# Altium project 0x2a002a.PrjPcb
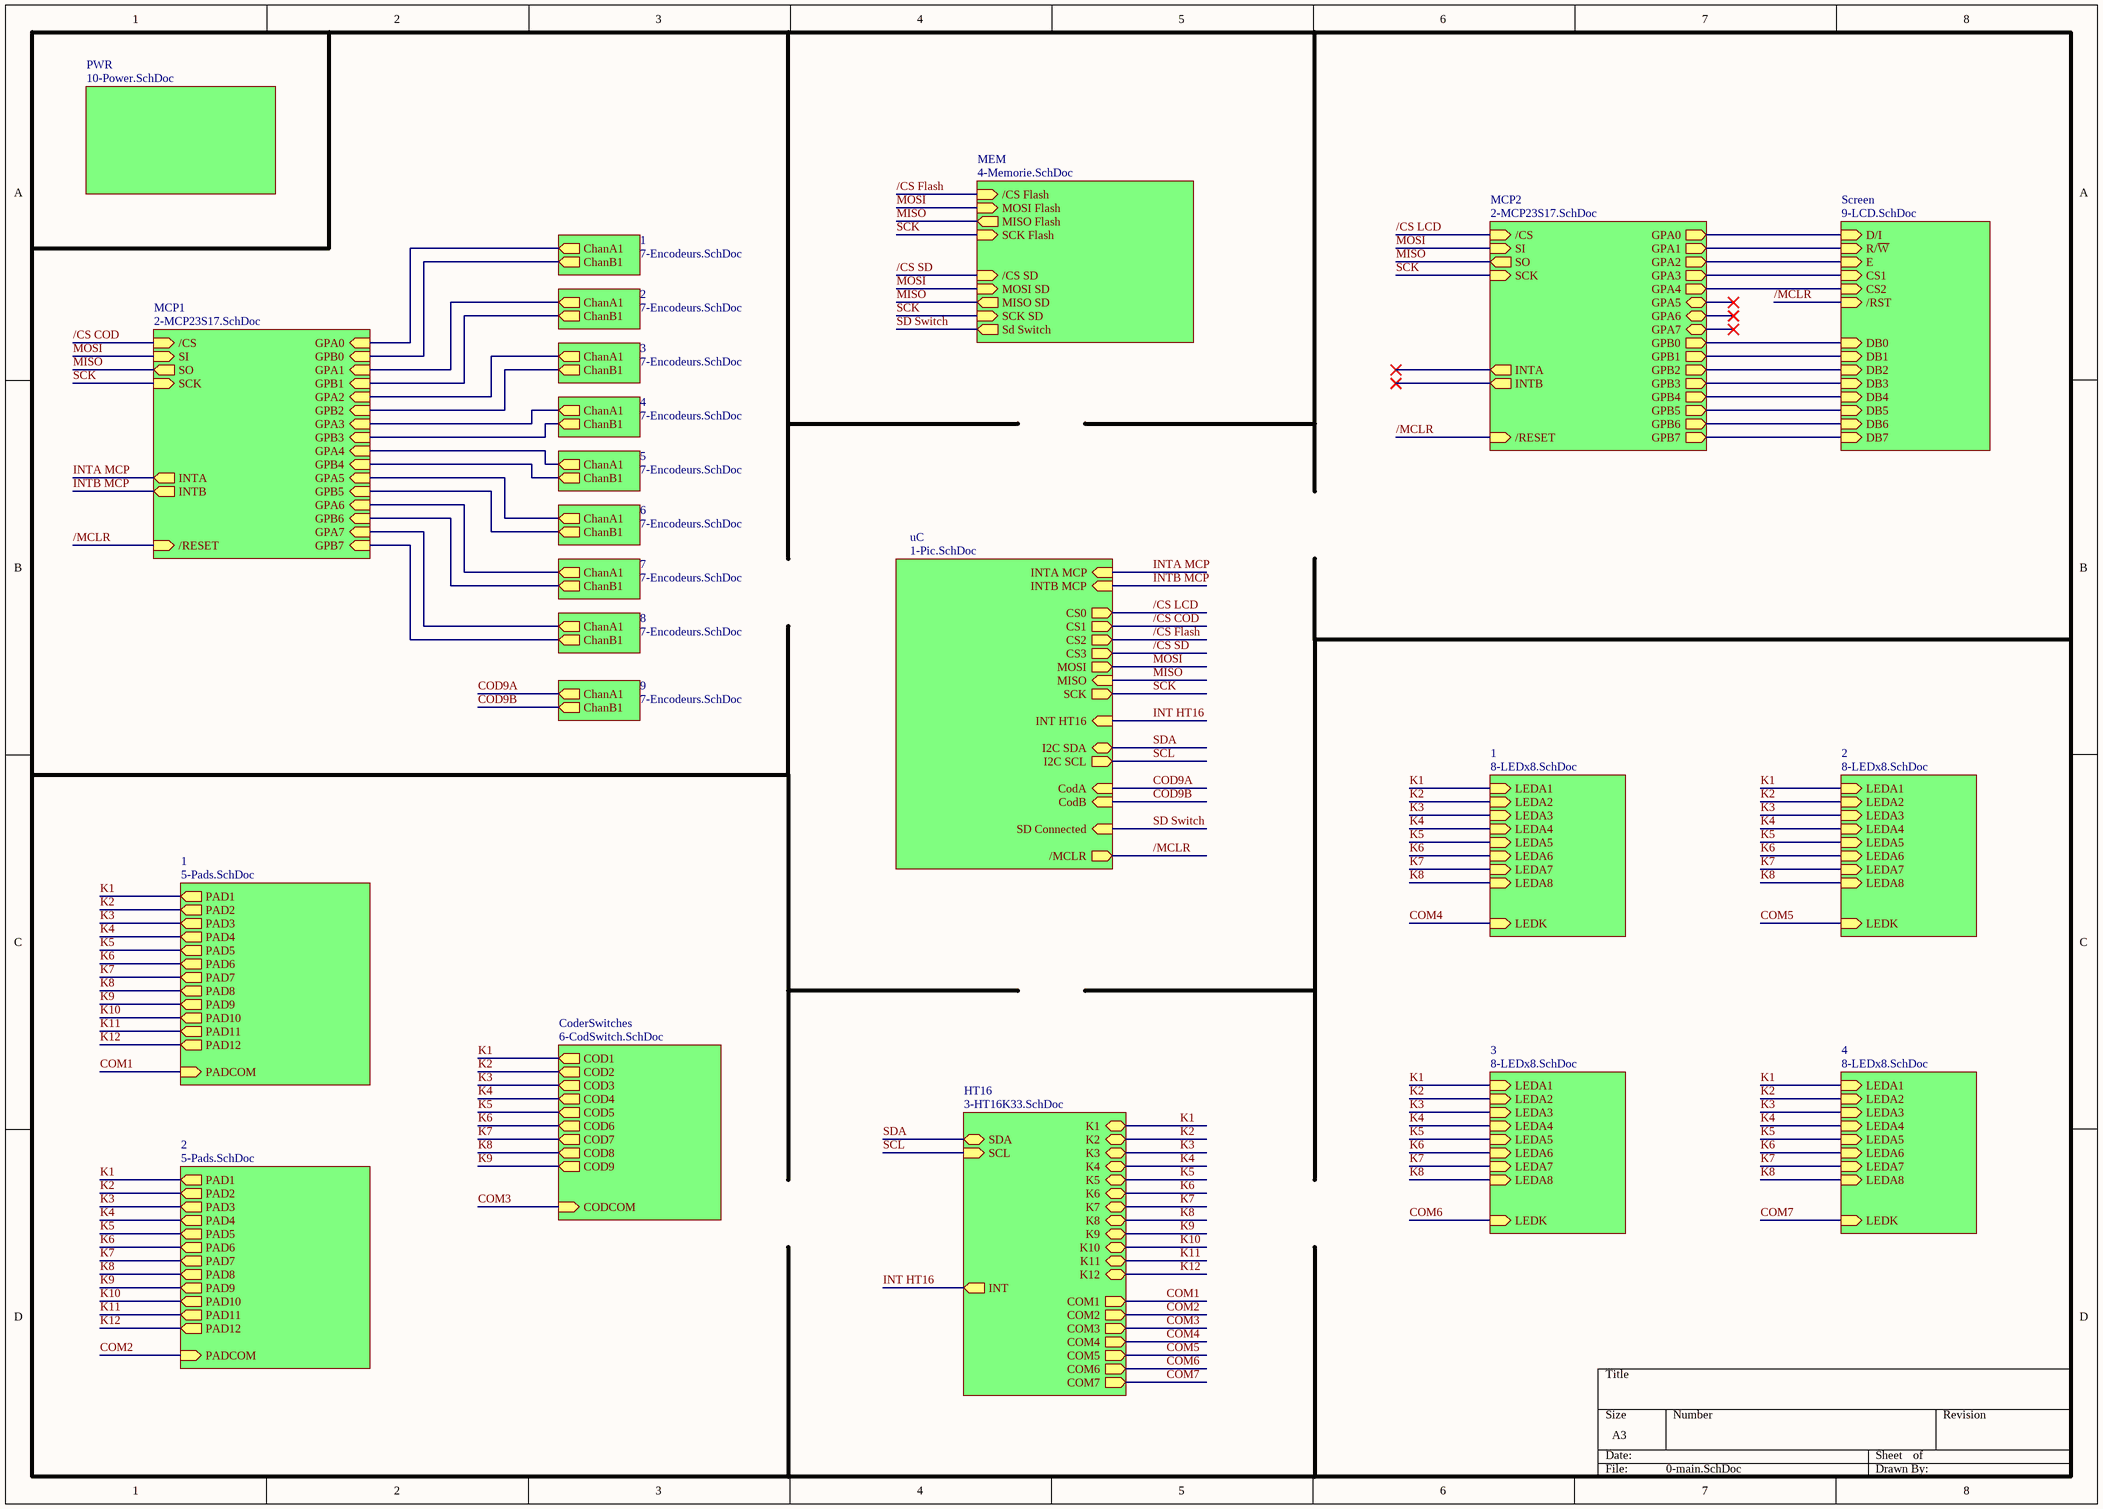
[diagram p0: 0-main.SchDoc]
11 sheets, 236 parts. Net scope: hierarchical (ports join the sheet entries above them; power ports are global).
Board file: PCB1.PcbDoc
Sheets:
  0-main.SchDoc
    uC = 1-Pic.SchDoc
    1 = 7-Encodeurs.SchDoc
    HT16 = 3-HT16K33.SchDoc
    PWR = 10-Power.SchDoc
    MCP1 = 2-MCP23S17.SchDoc
    MEM = 4-Memorie.SchDoc
    MCP2 = 2-MCP23S17.SchDoc
    2 = 7-Encodeurs.SchDoc
    3 = 7-Encodeurs.SchDoc
    4 = 7-Encodeurs.SchDoc
    5 = 7-Encodeurs.SchDoc
    6 = 7-Encodeurs.SchDoc
    7 = 7-Encodeurs.SchDoc
    8 = 7-Encodeurs.SchDoc
    9 = 7-Encodeurs.SchDoc
    Screen = 9-LCD.SchDoc
    1 = 8-LEDx8.SchDoc
    CoderSwitches = 6-CodSwitch.SchDoc
    2 = 5-Pads.SchDoc
    2 = 8-LEDx8.SchDoc
    3 = 8-LEDx8.SchDoc
    4 = 8-LEDx8.SchDoc
    1 = 5-Pads.SchDoc

## Sheet 0-main.SchDoc
size A3

### Sub-sheets
1 = 7-Encodeurs.SchDoc: ChanA1 (out), ChanB1 (out)
1 = 8-LEDx8.SchDoc: LEDA1 (in), LEDA2 (in), LEDA4 (in), LEDA3 (in), LEDA5 (in), LEDA6 (in), LEDA7 (in), LEDA8 (in), LEDK (in)
1 = 5-Pads.SchDoc: PAD1 (out), PAD2 (out), PAD3 (out), PAD4 (out), PAD5 (out), PAD6 (out), PAD8 (out), PAD7 (out), PAD9 (out), PAD10 (out), PAD11 (out), PAD12 (out), PADCOM (in)
2 = 7-Encodeurs.SchDoc: ChanA1 (out), ChanB1 (out)
2 = 5-Pads.SchDoc: PAD1 (out), PAD2 (out), PAD3 (out), PAD4 (out), PAD5 (out), PAD6 (out), PAD8 (out), PAD7 (out), PAD9 (out), PAD10 (out), PAD11 (out), PAD12 (out), PADCOM (in)
2 = 8-LEDx8.SchDoc: LEDA1 (in), LEDA2 (in), LEDA4 (in), LEDA3 (in), LEDA5 (in), LEDA6 (in), LEDA7 (in), LEDA8 (in), LEDK (in)
3 = 7-Encodeurs.SchDoc: ChanA1 (out), ChanB1 (out)
3 = 8-LEDx8.SchDoc: LEDA1 (in), LEDA2 (in), LEDA4 (in), LEDA3 (in), LEDA5 (in), LEDA6 (in), LEDA7 (in), LEDA8 (in), LEDK (in)
4 = 7-Encodeurs.SchDoc: ChanA1 (out), ChanB1 (out)
4 = 8-LEDx8.SchDoc: LEDA1 (in), LEDA2 (in), LEDA4 (in), LEDA3 (in), LEDA5 (in), LEDA6 (in), LEDA7 (in), LEDA8 (in), LEDK (in)
5 = 7-Encodeurs.SchDoc: ChanA1 (out), ChanB1 (out)
6 = 7-Encodeurs.SchDoc: ChanA1 (out), ChanB1 (out)
7 = 7-Encodeurs.SchDoc: ChanA1 (out), ChanB1 (out)
8 = 7-Encodeurs.SchDoc: ChanA1 (out), ChanB1 (out)
9 = 7-Encodeurs.SchDoc: ChanA1 (out), ChanB1 (out)
CoderSwitches = 6-CodSwitch.SchDoc: COD1 (out), COD2 (out), COD3 (out), COD4 (out), COD5 (out), COD6 (out), COD7 (out), COD8 (out), CODCOM (in), COD9 (out)
HT16 = 3-HT16K33.SchDoc: SDA (bidir), SCL (in), COM3 (out), COM2 (out), COM1 (out), K1 (bidir), K2 (bidir), K4 (bidir), K3 (bidir), K5 (bidir), K6 (bidir), K7 (bidir), K8 (bidir), K9 (bidir), K10 (bidir), K11 (bidir), INT (out), K12 (bidir), COM4 (out), COM5 (out), COM6 (out), COM7 (out)
MCP1 = 2-MCP23S17.SchDoc: GPA0 (in), GPB0 (in), GPA1 (in), GPB1 (in), GPA2 (in), GPA3 (in), GPB2 (in), GPB3 (in), GPA4 (in), GPB4 (in), GPA5 (in), GPB5 (in), GPA6 (in), GPB6 (in), GPA7 (in), GPB7 (in), INTA (out), INTB (out), /CS (in), SCK (in), SI (in), SO (out), /RESET (in)
MCP2 = 2-MCP23S17.SchDoc: INTA (out), INTB (out), /CS (in), SCK (in), SI (in), SO (out), /RESET (in), GPA0 (out), GPB0 (out), GPA1 (out), GPB1 (out), GPA2 (out), GPA3 (out), GPB2 (out), GPB3 (out), GPA4 (out), GPB4 (out), GPA5 (bidir), GPB5 (out), GPA6 (bidir), GPB6 (out), GPA7 (bidir), GPB7 (out)
MEM = 4-Memorie.SchDoc: /CS Flash (in), MOSI Flash (in), MISO Flash (out), SCK Flash (in), /CS SD (in), MISO SD (out), MOSI SD (in), SCK SD (in), Sd Switch (out)
PWR = 10-Power.SchDoc: no entries
Screen = 9-LCD.SchDoc: D/I (in), E (in), CS1 (in), CS2 (in), DB0 (in), DB1 (in), DB2 (in), DB3 (in), DB4 (in), DB5 (in), DB6 (in), DB7 (in), /RST (in), R/~{W} (in)
uC = 1-Pic.SchDoc: CodA (in), CodB (in), SCK (out), MOSI (out), MISO (in), CS2 (out), CS1 (out), CS0 (out), INTB MCP (in), INTA MCP (in), I2C SCL (out), I2C SDA (bidir), SD Connected (in), /MCLR (out), CS3 (out), INT HT16 (in)

### Nets
/CS COD: sheet uC/CS1, sheet MCP1//CS
/CS Flash: sheet uC/CS2, sheet MEM//CS Flash
/CS LCD: sheet uC/CS0, sheet MCP2//CS
/CS SD: sheet uC/CS3, sheet MEM//CS SD
/MCLR: sheet uC//MCLR, sheet MCP1//RESET, sheet MCP2//RESET, sheet Screen//RST
COD9A: sheet uC/CodA, sheet 9/ChanA1
COD9B: sheet uC/CodB, sheet 9/ChanB1
COM1: sheet HT16/COM1, sheet 1/PADCOM
COM2: sheet HT16/COM2, sheet 2/PADCOM
COM3: sheet HT16/COM3, sheet CoderSwitches/CODCOM
COM4: sheet HT16/COM4, sheet 1/LEDK
COM5: sheet HT16/COM5, sheet 2/LEDK
COM6: sheet HT16/COM6, sheet 3/LEDK
COM7: sheet HT16/COM7, sheet 4/LEDK
INT HT16: sheet uC/INT HT16, sheet HT16/INT
INTA MCP: sheet uC/INTA MCP, sheet MCP1/INTA
INTB MCP: sheet uC/INTB MCP, sheet MCP1/INTB
K1: sheet HT16/K1, sheet 1/LEDA1, sheet CoderSwitches/COD1, sheet 2/PAD1, sheet 2/LEDA1, sheet 3/LEDA1, sheet 4/LEDA1, sheet 1/PAD1
K2: sheet HT16/K2, sheet 1/LEDA2, sheet CoderSwitches/COD2, sheet 2/PAD2, sheet 2/LEDA2, sheet 3/LEDA2, sheet 4/LEDA2, sheet 1/PAD2
K3: sheet HT16/K3, sheet 1/LEDA3, sheet CoderSwitches/COD3, sheet 2/PAD3, sheet 2/LEDA3, sheet 3/LEDA3, sheet 4/LEDA3, sheet 1/PAD3
K4: sheet HT16/K4, sheet 1/LEDA4, sheet CoderSwitches/COD4, sheet 2/PAD4, sheet 2/LEDA4, sheet 3/LEDA4, sheet 4/LEDA4, sheet 1/PAD4
K5: sheet HT16/K5, sheet 1/LEDA5, sheet CoderSwitches/COD5, sheet 2/PAD5, sheet 2/LEDA5, sheet 3/LEDA5, sheet 4/LEDA5, sheet 1/PAD5
K6: sheet HT16/K6, sheet 1/LEDA6, sheet CoderSwitches/COD6, sheet 2/PAD6, sheet 2/LEDA6, sheet 3/LEDA6, sheet 4/LEDA6, sheet 1/PAD6
K7: sheet HT16/K7, sheet 1/LEDA7, sheet CoderSwitches/COD7, sheet 2/PAD7, sheet 2/LEDA7, sheet 3/LEDA7, sheet 4/LEDA7, sheet 1/PAD7
K8: sheet HT16/K8, sheet 1/LEDA8, sheet CoderSwitches/COD8, sheet 2/PAD8, sheet 2/LEDA8, sheet 3/LEDA8, sheet 4/LEDA8, sheet 1/PAD8
K9: sheet HT16/K9, sheet CoderSwitches/COD9, sheet 2/PAD9, sheet 1/PAD9
K10: sheet HT16/K10, sheet 2/PAD10, sheet 1/PAD10
K11: sheet HT16/K11, sheet 2/PAD11, sheet 1/PAD11
K12: sheet HT16/K12, sheet 2/PAD12, sheet 1/PAD12
MISO: sheet uC/MISO, sheet MCP1/SO, sheet MEM/MISO Flash, sheet MEM/MISO SD, sheet MCP2/SO
MOSI: sheet uC/MOSI, sheet MCP1/SI, sheet MEM/MOSI Flash, sheet MEM/MOSI SD, sheet MCP2/SI
SCK: sheet uC/SCK, sheet MCP1/SCK, sheet MEM/SCK Flash, sheet MEM/SCK SD, sheet MCP2/SCK
SCL: sheet uC/I2C SCL, sheet HT16/SCL
SD Switch: sheet uC/SD Connected, sheet MEM/Sd Switch
SDA: sheet uC/I2C SDA, sheet HT16/SDA
NetR73_1_2: sheet 1/ChanA1, sheet MCP1/GPA0
NetR73_2_2: sheet MCP1/GPA1, sheet 2/ChanA1
NetR73_3_2: sheet MCP1/GPA2, sheet 3/ChanA1
NetR73_4_2: sheet MCP1/GPA3, sheet 4/ChanA1
NetR73_5_2: sheet MCP1/GPA4, sheet 5/ChanA1
NetR73_6_2: sheet MCP1/GPA5, sheet 6/ChanA1
NetR73_7_2: sheet MCP1/GPA6, sheet 7/ChanA1
NetR73_8_2: sheet MCP1/GPA7, sheet 8/ChanA1
NetR74_1_2: sheet 1/ChanB1, sheet MCP1/GPB0
NetR74_2_2: sheet MCP1/GPB1, sheet 2/ChanB1
NetR74_3_2: sheet MCP1/GPB2, sheet 3/ChanB1
NetR74_4_2: sheet MCP1/GPB3, sheet 4/ChanB1
NetR74_5_2: sheet MCP1/GPB4, sheet 5/ChanB1
NetR74_6_2: sheet MCP1/GPB5, sheet 6/ChanB1
NetR74_7_2: sheet MCP1/GPB6, sheet 7/ChanB1
NetR74_8_2: sheet MCP1/GPB7, sheet 8/ChanB1
NetU3_MCP2_1: sheet MCP2/GPB0, sheet Screen/DB0
NetU3_MCP2_2: sheet MCP2/GPB1, sheet Screen/DB1
NetU3_MCP2_3: sheet MCP2/GPB2, sheet Screen/DB2
NetU3_MCP2_4: sheet MCP2/GPB3, sheet Screen/DB3
NetU3_MCP2_5: sheet MCP2/GPB4, sheet Screen/DB4
NetU3_MCP2_6: sheet MCP2/GPB5, sheet Screen/DB5
NetU3_MCP2_7: sheet MCP2/GPB6, sheet Screen/DB6
NetU3_MCP2_8: sheet MCP2/GPB7, sheet Screen/DB7
NetU3_MCP2_21: sheet MCP2/GPA0, sheet Screen/D/I
NetU3_MCP2_22: sheet MCP2/GPA1, sheet Screen/R/~{W}
NetU3_MCP2_23: sheet MCP2/GPA2, sheet Screen/E
NetU3_MCP2_24: sheet MCP2/GPA3, sheet Screen/CS1
NetU3_MCP2_25: sheet MCP2/GPA4, sheet Screen/CS2

## Sheet 1-Pic.SchDoc
size A4
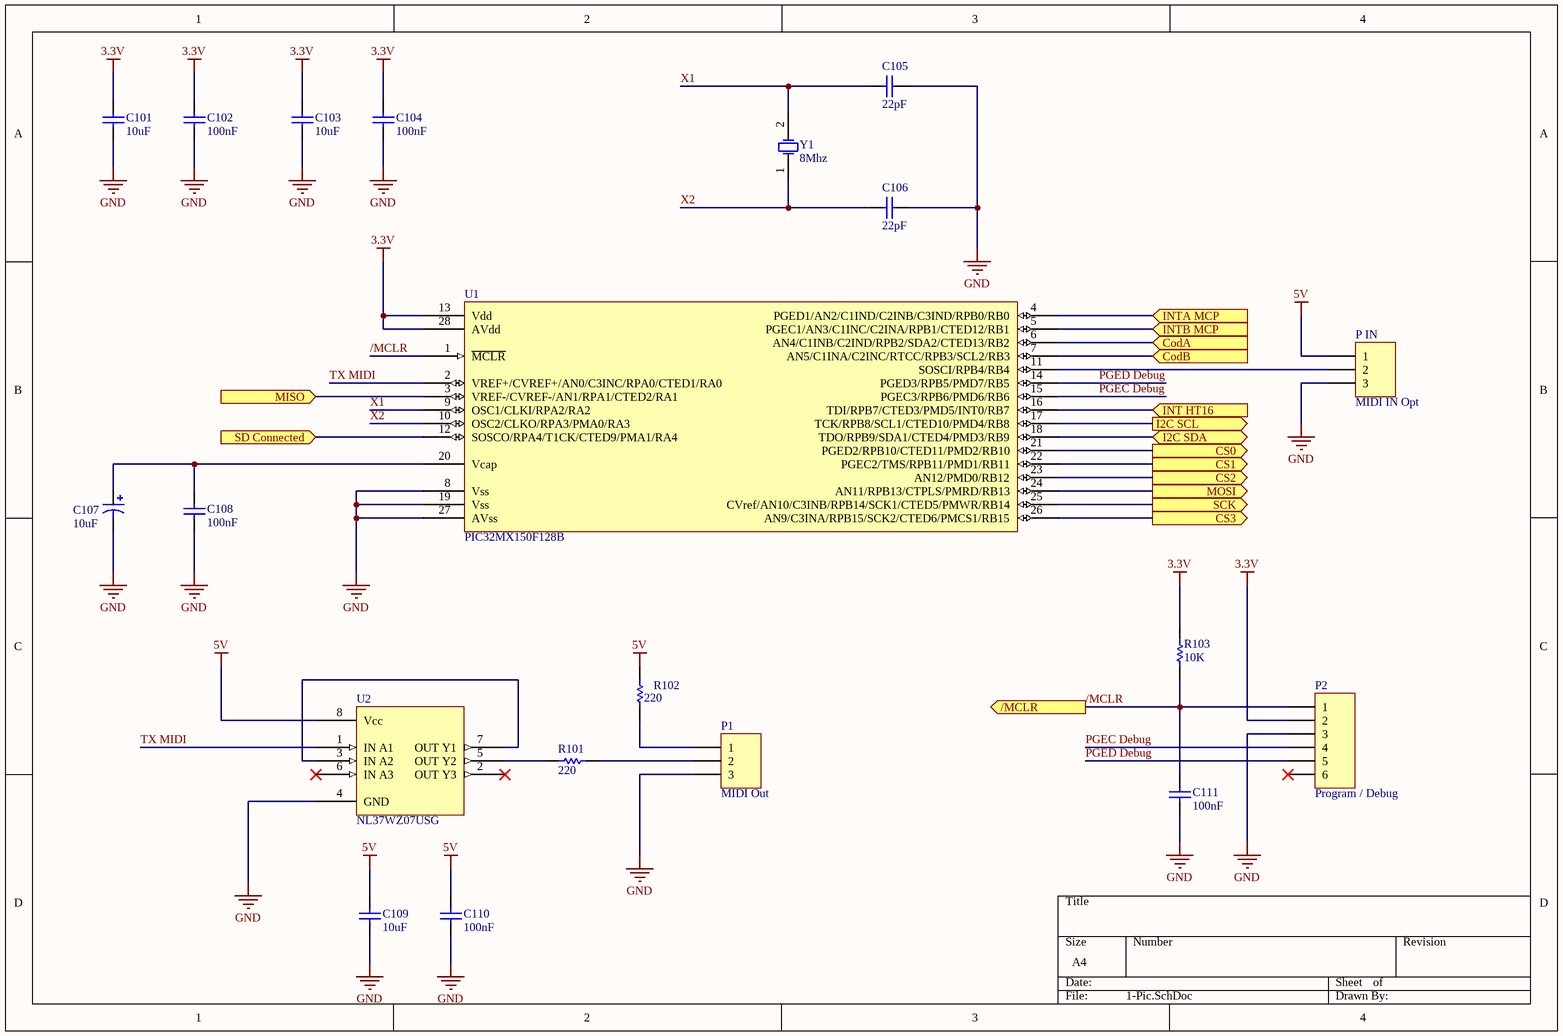
[diagram p1: 1-Pic.SchDoc]

### Parts
C101  10uF  [capa 1206]
C102  100nF  [capa 1206]
C103  10uF  [capa 1206]
C104  100nF  [capa 1206]
C105  22pF  [capa 1206]
C106  22pF  [capa 1206]
C107  10uF  [CAPA 1206 POL]
C108  100nF  [capa 1206]
C109  10uF  [capa 1206]
C110  100nF  [capa 1206]
C111  100nF  [capa 1206]
P1  MIDI Out  [MIDI]
P2  Program / Debug  [HDR1X6]
P_IN  MIDI IN Opt  [MIDI]
R101  220  [RES 1206]
R102  220  [RES 1206]
R103  10K  [RES 1206]
U1  PIC32MX150F128B  [PIC32MX150F128B-I/SO]
U2  NL37WZ07USG  [NL37WZ07USG]
Y1  8Mhz  [HC49/4H SMX CRYSTAL]

### Ports
/MCLR (out), CodA (in), CodB (in), CS0 (out), CS1 (out), CS2 (out), CS3 (out), I2C SCL (out), I2C SDA, INT HT16 (in), INTA MCP (in), INTB MCP (in), MISO (in), MOSI (out), SCK (out), SD Connected (in)

### Nets
3.3V: C101.1 C102.1 C103.1 C104.1 P2.2 R103.2 U1.13(Vdd) U1.28(AVdd)
5V: C109.1 C110.1 P_IN.1 R102.2 U2.8(Vcc)
GND: C101.2 C102.2 C103.2 C104.2 C105.2 C106.2 C107.2 C108.2 C109.2 C110.2 C111.1 P1.3 P2.3 P_IN.3 U1.8(Vss) U1.19(Vss) U1.27(AVss) U2.4(GND)
/CS COD: U1.22(PGEC2/TMS/RPB11/PMD1/RB11) ; port CS1
/CS Flash: U1.23(AN12/PMD0/RB12) ; port CS2
/CS LCD: U1.21(PGED2/RPB10/CTED11/PMD2/RB10) ; port CS0
/CS SD: U1.26(AN9/C3INA/RPB15/SCK2/CTED6/PMCS1/RB15) ; port CS3
/MCLR: C111.2 P2.1 R103.1 U1.1(~{MCLR}) ; port /MCLR
COD9A: U1.6(AN4/C1INB/C2IND/RPB2/SDA2/CTED13/RB2) ; port CodA
COD9B: U1.7(AN5/C1INA/C2INC/RTCC/RPB3/SCL2/RB3) ; port CodB
INT HT16: U1.16(TDI/RPB7/CTED3/PMD5/INT0/RB7) ; port INT HT16
INTA MCP: U1.4(PGED1/AN2/C1IND/C2INB/C3IND/RPB0/RB0) ; port INTA MCP
INTB MCP: U1.5(PGEC1/AN3/C1INC/C2INA/RPB1/CTED12/RB1) ; port INTB MCP
MISO: U1.3(VREF-/CVREF-/AN1/RPA1/CTED2/RA1) ; port MISO
MOSI: U1.24(AN11/RPB13/CTPLS/PMRD/RB13) ; port MOSI
PGEC Debug: P2.4 U1.15(PGEC3/RPB6/PMD6/RB6)
PGED Debug: P2.5 U1.14(PGED3/RPB5/PMD7/RB5)
SCK: U1.25(CVref/AN10/C3INB/RPB14/SCK1/CTED5/PMWR/RB14) ; port SCK
SCL: U1.17(TCK/RPB8/SCL1/CTED10/PMD4/RB8) ; port I2C SCL
SD Switch: U1.12(SOSCO/RPA4/T1CK/CTED9/PMA1/RA4) ; port SD Connected
SDA: U1.18(TDO/RPB9/SDA1/CTED4/PMD3/RB9) ; port I2C SDA
TX MIDI: U1.2(VREF+/CVREF+/AN0/C3INC/RPA0/CTED1/RA0) U2.1(IN_A1)
X1: C105.1 U1.9(OSC1/CLKI/RPA2/RA2) Y1.2(OSC2)
X2: C106.1 U1.10(OSC2/CLKO/RPA3/PMA0/RA3) Y1.1(OSC1)
NetC107_1: C107.1 C108.1 U1.20(Vcap)
NetP1_1: P1.1 R102.1
NetP1_2: P1.2 R101.1
NetP_IN_2: P_IN.2 U1.11(SOSCI/RPB4/RB4)
NetR101_2: R101.2 U2.5(OUT_Y2)
NetU2_3: U2.3(IN_A2) U2.7(OUT_Y1)

Not connected (* = marked no-connect by the designer): P2 6*; U2 2(OUT_Y3)* 6(IN_A3)*

### Library data of the parts
C101 C103 C109 = Cap: Capacitor; Fabricant: MULTICOMP; Fournisseur: Farnell; RefFabricant: MC1206X106K160CT; RefFournisseur: 2320922
C102 C104 C108 C110 C111 = Cap: Capacitor; Fabricant: MULTICOMP; Fournisseur: Farnell; RefFabricant: MC1206B104K500CT; RefFournisseur: 1759361
C105 C106 = Cap: Capacitor; Fabricant: MULTICOMP; Fournisseur: Farnell; RefFabricant: MC1206N220J101CT; RefFournisseur: 2320864
C107 = Cap Pol1: Polarized Capacitor (Radial); Fabricant: KEMET; Fournisseur: Farnell; RefFabricant: T491A106K010AT; RefFournisseur: 1457413
P1 P_IN = Header 3: Header, 3-Pin; Fabricant: N/A; Fournisseur: N/A; RefFabricant: N/A; RefFournisseur: N/A
P2 = Header 6: Header, 6-Pin; Fabricant: N/A; Fournisseur: N/A; RefFabricant: N/A; RefFournisseur: N/A
R101 R102 = Res1: Resistor; Fabricant: MULTICOMP; Fournisseur: Farnell; RefFabricant: MC0125W12065220R; RefFournisseur: 9337210
R103 = Res1: Resistor; Fabricant: MULTICOMP; Fournisseur: Farmell; RefFabricant: MC0125W1206510K; RefFournisseur: 9337016
U1 = PIC32MX150F128B: Fabricant: Microchip; Fournisseur: Farnell; RefFournisseur: 2313766; RefFabricant: PIC32MX150F128B-I/SO
U2 = NL37WZ07USG: Fabricant: ON SEMICONDUCTOR; Fournisseur: Farnell; RefFournisseur: 2534491; RefFabricant: NL37WZ07USG
Y1 = XTAL: Crystal Oscillator; Fabricant: FOX ELECTRONICS; Fournisseur: Farnell; RefFabricant: FOXSDLF/080-20; RefFournisseur: 2063972

## Sheet 7-Encodeurs.SchDoc
size A4
Used 9 times, as channels 1, 2, 3, 4, 5, 6, 7, 8, 9. Parts and nets are listed once, with the designators drawn on the sheet.
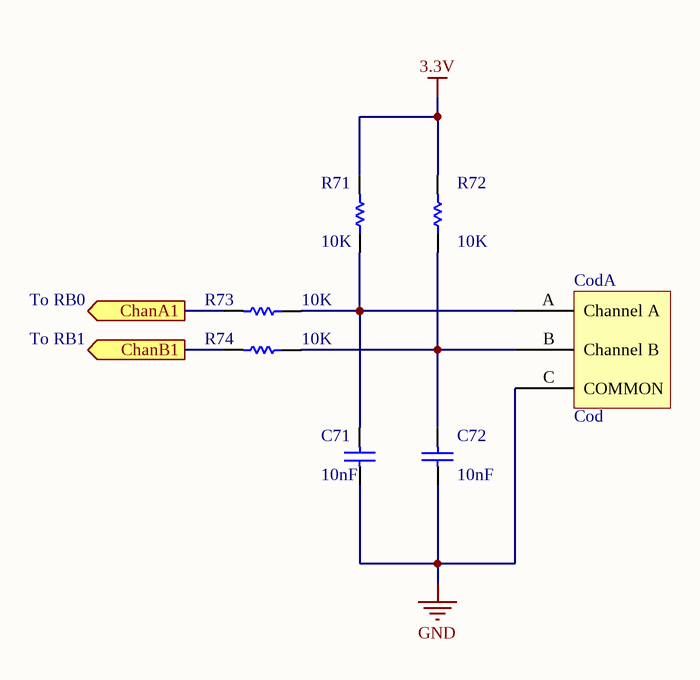
[diagram p2: 7-Encodeurs.SchDoc]

### Parts
C71  10nF  [capa 1206]
C72  10nF  [capa 1206]
Cod  Cod  (part A of 2)
R71  10K  [RES 1206]
R72  10K  [RES 1206]
R73  10K  [RES 1206]
R74  10K  [RES 1206]

### Ports
ChanA1 (out), ChanB1 (out)

### Nets
3.3V: R71.2 R72.2
GND: C71.1 C72.2 Cod.C(COMMON)
ChanA1: R73.2 ; port ChanA1
ChanB1: R74.2 ; port ChanB1
NetC71_2: C71.2 Cod.A(Channel_A) R71.1 R73.1
NetC72_1: C72.1 Cod.B(Channel_B) R72.1 R74.1

### Channels
1: designators C71=C71_1 C72=C72_1 Cod=Cod_1#1 R71=R71_1 R72=R72_1 R73=R73_1 R74=R74_1; ports ChanA1=NetR73_1_2 ChanB1=NetR74_1_2
2: designators C71=C71_2 C72=C72_2 Cod=Cod_2#1 R71=R71_2 R72=R72_2 R73=R73_2 R74=R74_2; ports ChanA1=NetR73_2_2 ChanB1=NetR74_2_2
3: designators C71=C71_3 C72=C72_3 Cod=Cod_3#1 R71=R71_3 R72=R72_3 R73=R73_3 R74=R74_3; ports ChanA1=NetR73_3_2 ChanB1=NetR74_3_2
4: designators C71=C71_4 C72=C72_4 Cod=Cod_4#1 R71=R71_4 R72=R72_4 R73=R73_4 R74=R74_4; ports ChanA1=NetR73_4_2 ChanB1=NetR74_4_2
5: designators C71=C71_5 C72=C72_5 Cod=Cod_5#1 R71=R71_5 R72=R72_5 R73=R73_5 R74=R74_5; ports ChanA1=NetR73_5_2 ChanB1=NetR74_5_2
6: designators C71=C71_6 C72=C72_6 Cod=Cod_6#1 R71=R71_6 R72=R72_6 R73=R73_6 R74=R74_6; ports ChanA1=NetR73_6_2 ChanB1=NetR74_6_2
7: designators C71=C71_7 C72=C72_7 Cod=Cod_7#1 R71=R71_7 R72=R72_7 R73=R73_7 R74=R74_7; ports ChanA1=NetR73_7_2 ChanB1=NetR74_7_2
8: designators C71=C71_8 C72=C72_8 Cod=Cod_8#1 R71=R71_8 R72=R72_8 R73=R73_8 R74=R74_8; ports ChanA1=NetR73_8_2 ChanB1=NetR74_8_2
9: designators C71=C71_9 C72=C72_9 Cod=Cod_9#1 R71=R71_9 R72=R72_9 R73=R73_9 R74=R74_9; ports ChanA1=COD9A ChanB1=COD9B

### Notes on the sheet
- To RB0
- To RB1

### Library data of the parts
C71 C72 = Cap: Capacitor; Fabricant: MULTICOMP; Fournisseur: Farnell; RefFabricant: MC1206B103M631CT; RefFournisseur: 1709222
R71-R74 = Res1: Resistor; Fabricant: MULTICOMP; Fournisseur: Farnell; RefFabricant: MC0125W1206510K; RefFournisseur: 9337016
Cod = Cod: Fabricant: N/A; Fournisseur: N/A; RefFabricant: N/A; RefFournisseur: N/A

## Sheet 3-HT16K33.SchDoc
size A4
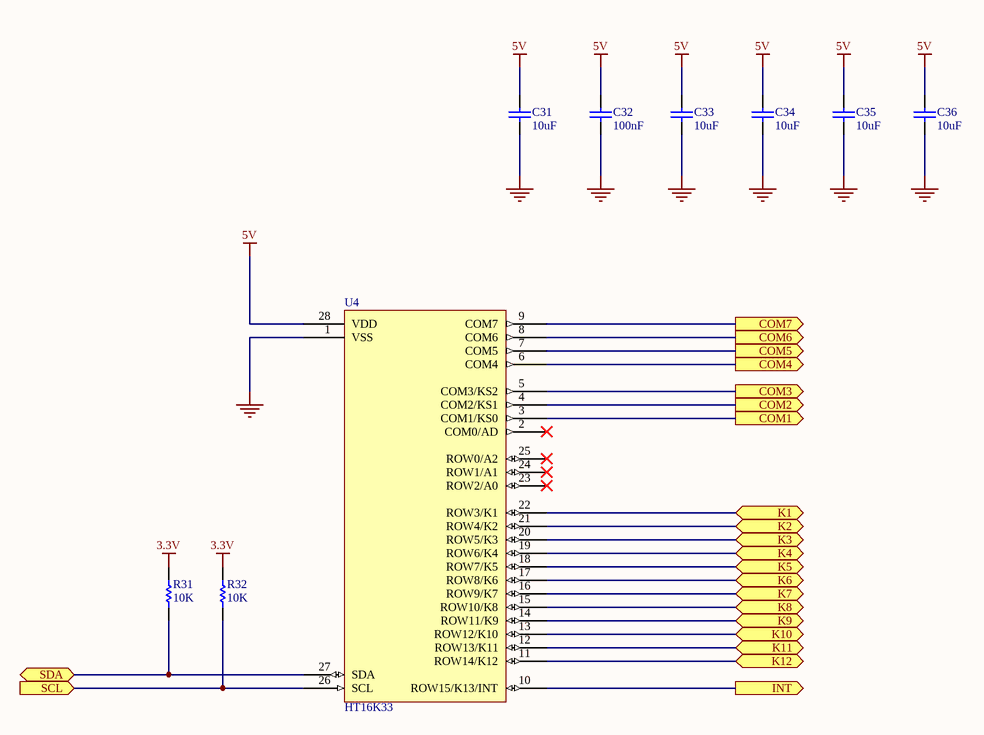
[diagram p3: 3-HT16K33.SchDoc]

### Parts
C31  10uF  [capa 1206]
C32  100nF  [capa 1206]
C33  10uF  [capa 1206]
C34  10uF  [capa 1206]
C35  10uF  [capa 1206]
C36  10uF  [capa 1206]
R31  10K  [RES 1206]
R32  10K  [RES 1206]
U4  HT16K33  [HT16K33 SOP]

### Ports
COM1 (out), COM2 (out), COM3 (out), COM4 (out), COM5 (out), COM6 (out), COM7 (out), INT (out), K1 (bidir), K2 (bidir), K3 (bidir), K4 (bidir), K5 (bidir), K6 (bidir), K7 (bidir), K8 (bidir), K9 (bidir), K10 (bidir), K11 (bidir), K12 (bidir), SCL (in), SDA (bidir)

### Nets
3.3V: R31.1 R32.2
5V: C31.2 C32.2 C33.2 C34.2 C35.2 C36.2 U4.28(VDD)
GND: C31.1 C32.1 C33.1 C34.1 C35.1 C36.1 U4.1(VSS)
COM1: U4.3(COM1/KS0) ; port COM1
COM2: U4.4(COM2/KS1) ; port COM2
COM3: U4.5(COM3/KS2) ; port COM3
COM4: U4.6(COM4) ; port COM4
COM5: U4.7(COM5) ; port COM5
COM6: U4.8(COM6) ; port COM6
COM7: U4.9(COM7) ; port COM7
INT HT16: U4.10(ROW15/K13/INT) ; port INT
K1: U4.22(ROW3/K1) ; port K1
K2: U4.21(ROW4/K2) ; port K2
K3: U4.20(ROW5/K3) ; port K3
K4: U4.19(ROW6/K4) ; port K4
K5: U4.18(ROW7/K5) ; port K5
K6: U4.17(ROW8/K6) ; port K6
K7: U4.16(ROW9/K7) ; port K7
K8: U4.15(ROW10/K8) ; port K8
K9: U4.14(ROW11/K9) ; port K9
K10: U4.13(ROW12/K10) ; port K10
K11: U4.12(ROW13/K11) ; port K11
K12: U4.11(ROW14/K12) ; port K12
SCL: R32.1 U4.26(SCL) ; port SCL
SDA: R31.2 U4.27(SDA) ; port SDA

Not connected (* = marked no-connect by the designer): U4 2(COM0/AD)* 23(ROW2/A0)* 24(ROW1/A1)* 25(ROW0/A2)*

### Library data of the parts
C31 C33-C36 = Cap: as C101 on sheet 1-Pic
C32 = Cap: as C102 on sheet 1-Pic
R31 R32 = Res1: Resistor
U4 = HT16K33: Fabricant: Holtek; Fournisseur: AliExpress; RefFabricant: HT16K33-28SOP; RefFournisseur: N/A

## Sheet 10-Power.SchDoc
size A4
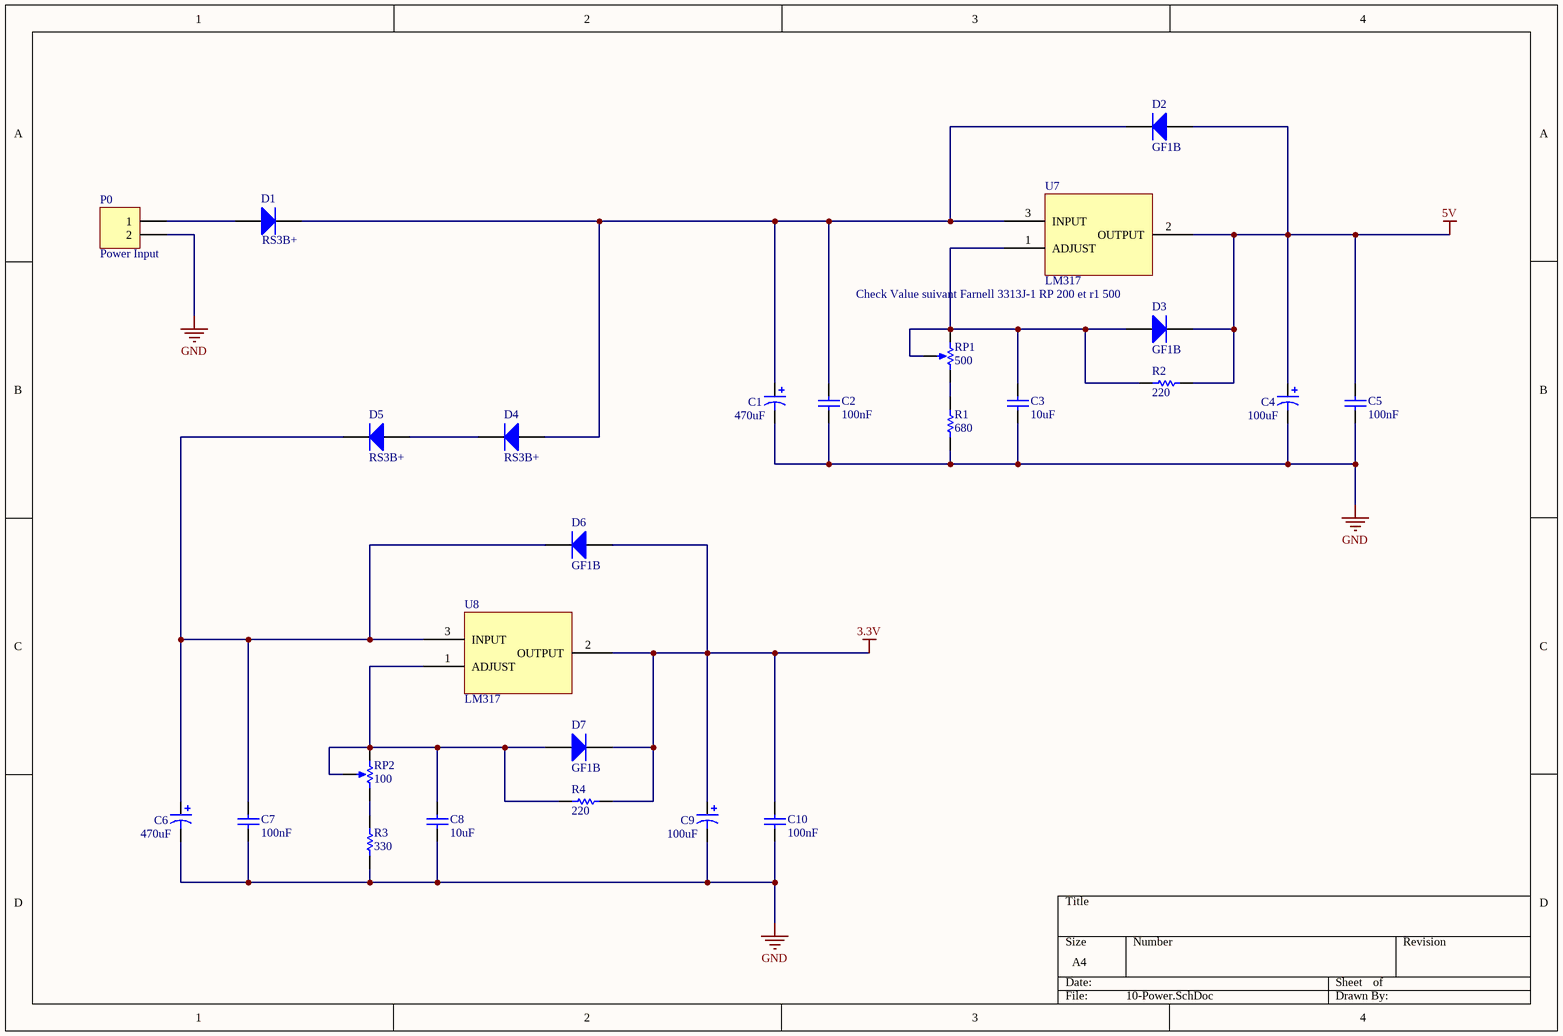
[diagram p4: 10-Power.SchDoc]

### Parts
C1  470uF  [CAPA PANA SIZE D*]
C2  100nF  [capa 1206]
C3  10uF  [capa 1206]
C4  100uF  [CAPA PANA SIZE D*]
C5  100nF  [capa 1206]
C6  470uF  [CAPA PANA SIZE D*]
C7  100nF  [capa 1206]
C8  10uF  [capa 1206]
C9  100uF  [CAPA PANA SIZE D*]
C10  100nF  [capa 1206]
D1  RS3B+  [SMC Vishay]
D2  GF1B  [DO-214AC(SMA)]
D3  GF1B  [DO-214AC(SMA)]
D4  RS3B+  [SMC Vishay]
D5  RS3B+  [SMC Vishay]
D6  GF1B  [DO-214AC(SMA)]
D7  GF1B  [DO-214AC(SMA)]
P0  Power Input  [PWR]
R1  680  [RES 1206]
R2  220  [RES 1206]
R3  330  [RES 1206]
R4  220  [RES 1206]
RP1  500  [3313J-1]
RP2  100  [3313J-1]
U7  LM317  [D2PAK]
U8  LM317  [D2PAK]

### Nets
3.3V: C9.1 C10.2 D6.1(A) D7.2(K) R4.1 U8.2(OUTPUT)
5V: C4.1 C5.2 D2.1(A) D3.2(K) R2.1 U7.2(OUTPUT)
GND: C1.2 C2.1 C3.1 C4.2 C5.1 C6.2 C7.1 C8.1 C9.2 C10.1 P0.2 R1.1 R3.2
NetC1_1: C1.1 C2.2 D1.2(K) D2.2(K) D4.1(A) U7.3(INPUT)
NetC3_2: C3.2 D3.1(A) R2.2 RP1.1(TOP) RP1.3(TAP) U7.1(ADJUST)
NetC6_1: C6.1 C7.2 D5.2(K) D6.2(K) U8.3(INPUT)
NetC8_2: C8.2 D7.1(A) R4.2 RP2.1(TOP) RP2.3(TAP) U8.1(ADJUST)
NetD1_1: D1.1(A) P0.1
NetD4_2: D4.2(K) D5.1(A)
NetR1_2: R1.2 RP1.2(BOT)
NetR3_1: R3.1 RP2.2(BOT)

### Notes on the sheet
- Check Value suivant Farnell 3313J-1 RP 200 et r1 500

### Library data of the parts
C1 C6 = Cap Pol1: Polarized Capacitor (Radial); Fabricant: PANASONIC; Fournisseur: Farnell; RefFabricant: EEEFTA471XAP; RefFournisseur: 2065963
C2 C5 C7 C10 = Cap: as C102 on sheet 1-Pic
C3 C8 = Cap: as C101 on sheet 1-Pic
C4 C9 = Cap Pol1: Polarized Capacitor (Radial); Fabricant: PANASONIC; Fournisseur: Farnell; RefFabricant: EEE1AA101SP; RefFournisseur: 2326098
D1 D4 D5 = Diode: Default Diode; Fabricant: MULTICOMP; Fournisseur: Farnell; RefFournisseur: 2675034RL; RefFabricant: RS3B+
D2 D3 D6 D7 = Diode: Default Diode; Fabricant: FAIRCHILD SEMICONDUCTOR; Fournisseur: Farnell; RefFournisseur: 1467477; RefFabricant: GF1B
P0 = Header 2: Header, 2-Pin; Fabricant: N/A; Fournisseur: N/A; RefFabricant: N/A; RefFournisseur: N/A
R1 = Res1: Resistor; Fabricant: MULTICOMP; Fournisseur: Farnell; RefFabricant: MC0125W12065680R; RefFournisseur: 9337547
R2 R4 = Res1: as R101 on sheet 1-Pic
R3 = Res1: Resistor; Fabricant: MULTICOMP; Fournisseur: Farnell; RefFabricant: MC0125W12065330R; RefFournisseur: 9337326
RP1 = RPot: Potentiometer; Fabricant: BOURNS; Fournisseur: Farnell; RefFabricant: 3313J-1-501E; RefFournisseur: 1689904
RP2 = RPot: Potentiometer; Fabricant: BOURNS; Fournisseur: Farnell; RefFabricant: 3313J-1-101E; RefFournisseur: 2321829
U7 U8 = LM317: Fabricant: ON SEMICONDUCTOR; Fournisseur: Farnell; RefFabricant: LM317D2T-TR; RefFournisseur: 1564300

## Sheet 2-MCP23S17.SchDoc
size A4
Used 2 times, as channels MCP1, MCP2. Parts and nets are listed once, with the designators drawn on the sheet.
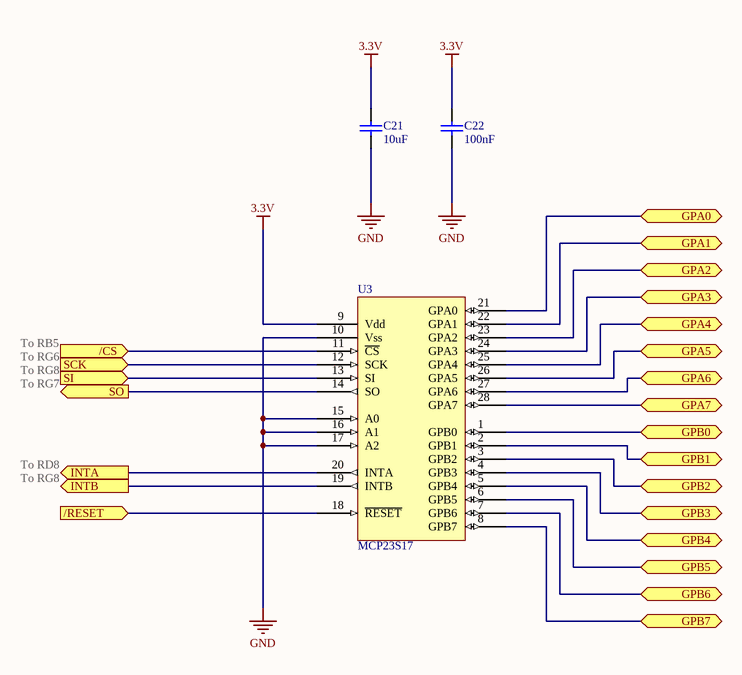
[diagram p5: 2-MCP23S17.SchDoc]

### Parts
C21  10uF  [capa 1206]
C22  100nF  [capa 1206]
U3  MCP23S17  [MCP23S17-E/SO]

### Ports
/CS (in), /RESET (in), GPA0 (bidir), GPA1 (bidir), GPA2 (bidir), GPA3 (bidir), GPA4 (bidir), GPA5 (bidir), GPA6 (bidir), GPA7 (bidir), GPB0 (bidir), GPB1 (bidir), GPB2 (bidir), GPB3 (bidir), GPB4 (bidir), GPB5 (bidir), GPB6 (bidir), GPB7 (bidir), INTA (out), INTB (out), SCK (in), SI (in), SO (out)

### Nets
3.3V: C21.1 C22.1 U3.9(Vdd)
GND: C21.2 C22.2 U3.10(Vss) U3.15(A0) U3.16(A1) U3.17(A2)
/CS: U3.11(~{CS}) ; port /CS
/RESET: U3.18(~{RESET}) ; port /RESET
GPA0: U3.21(GPA0) ; port GPA0
GPA1: U3.22(GPA1) ; port GPA1
GPA2: U3.23(GPA2) ; port GPA2
GPA3: U3.24(GPA3) ; port GPA3
GPA4: U3.25(GPA4) ; port GPA4
GPA5: U3.26(GPA5) ; port GPA5
GPA6: U3.27(GPA6) ; port GPA6
GPA7: U3.28(GPA7) ; port GPA7
GPB0: U3.1(GPB0) ; port GPB0
GPB1: U3.2(GPB1) ; port GPB1
GPB2: U3.3(GPB2) ; port GPB2
GPB3: U3.4(GPB3) ; port GPB3
GPB4: U3.5(GPB4) ; port GPB4
GPB5: U3.6(GPB5) ; port GPB5
GPB6: U3.7(GPB6) ; port GPB6
GPB7: U3.8(GPB7) ; port GPB7
INTA: U3.20(INTA) ; port INTA
INTB: U3.19(INTB) ; port INTB
SCK: U3.12(SCK) ; port SCK
SI: U3.13(SI) ; port SI
SO: U3.14(SO) ; port SO

### Channels
MCP1: designators end in _MCP1; ports /CS=/CS COD /RESET=/MCLR GPA0=NetR73_1_2 GPA1=NetR73_2_2 GPA2=NetR73_3_2 GPA3=NetR73_4_2 GPA4=NetR73_5_2 GPA5=NetR73_6_2 GPA6=NetR73_7_2 GPA7=NetR73_8_2 GPB0=NetR74_1_2 GPB1=NetR74_2_2 GPB2=NetR74_3_2 GPB3=NetR74_4_2 GPB4=NetR74_5_2 GPB5=NetR74_6_2 GPB6=NetR74_7_2 GPB7=NetR74_8_2 INTA=INTA MCP INTB=INTB MCP SCK=SCK SI=MOSI SO=MISO
MCP2: designators end in _MCP2; ports /CS=/CS LCD /RESET=/MCLR GPA0=NetU3_MCP2_21 GPA1=NetU3_MCP2_22 GPA2=NetU3_MCP2_23 GPA3=NetU3_MCP2_24 GPA4=NetU3_MCP2_25 GPA5=NetU3_MCP2_26 GPA6=NetU3_MCP2_27 GPA7=NetU3_MCP2_28 GPB0=NetU3_MCP2_1 GPB1=NetU3_MCP2_2 GPB2=NetU3_MCP2_3 GPB3=NetU3_MCP2_4 GPB4=NetU3_MCP2_5 GPB5=NetU3_MCP2_6 GPB6=NetU3_MCP2_7 GPB7=NetU3_MCP2_8 INTA=NetU3_MCP2_20 INTB=NetU3_MCP2_19 SCK=SCK SI=MOSI SO=MISO

### Notes on the sheet
- To RB5
- To RG6
- To RG8
- To RG7
- To RD8

### Library data of the parts
C21 = Cap: as C101 on sheet 1-Pic
C22 = Cap: as C102 on sheet 1-Pic
U3 = MCP23S17: Fabricant: Microchip; Fournisseur: Farnell; RefFournisseur: 1332093; RefFabricant: MCP23S17-E/SO

## Sheet 4-Memorie.SchDoc
size A4
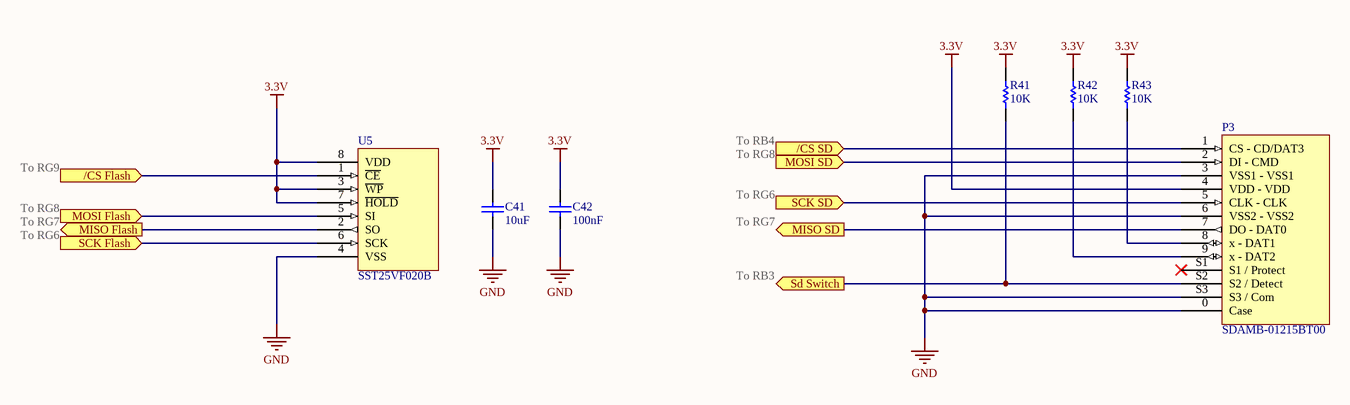
[diagram p6: 4-Memorie.SchDoc]

### Parts
C41  10uF  [capa 1206]
C42  100nF  [capa 1206]
P3  SDAMB-01215BT00
R41  10K  [RES 1206]
R42  10K  [RES 1206]
R43  10K  [RES 1206]
U5  SST25VF020B  [SST25VF020B]

### Ports
/CS Flash (in), /CS SD (in), MISO Flash (out), MISO SD (out), MOSI Flash (in), MOSI SD (in), SCK Flash (in), SCK SD (in), Sd Switch (out)

### Nets
3.3V: C41.1 C42.1 P3.4(VDD_-_VDD) R41.2 R42.2 R43.2 U5.3(~{WP}) U5.7(~{HOLD}) U5.8(VDD)
GND: C41.2 C42.2 P3.0(Case) P3.3(VSS1_-_VSS1) P3.6(VSS2_-_VSS2) P3.S3(S3_/_Com) U5.4(VSS)
/CS Flash: U5.1(~{CE}) ; port /CS Flash
/CS SD: P3.1(CS_-_CD/DAT3) ; port /CS SD
MISO: P3.7(DO_-_DAT0) U5.2(SO) ; port MISO Flash, port MISO SD
MOSI: P3.2(DI_-_CMD) U5.5(SI) ; port MOSI Flash, port MOSI SD
SCK: P3.5(CLK_-_CLK) U5.6(SCK) ; port SCK Flash, port SCK SD
SD Switch: P3.S2(S2_/_Detect) R41.1 ; port Sd Switch
NetP3_8: P3.8(x_-_DAT1) R43.1
NetP3_9: P3.9(x_-_DAT2) R42.1

Not connected (* = marked no-connect by the designer): P3 S1(S1_/_Protect)*

### Notes on the sheet
- To RG9
- To RB4
- To RG8
- To RG7
- To RG6
- To RB3

### Library data of the parts
C41 = Cap: as C101 on sheet 1-Pic
C42 = Cap: as C102 on sheet 1-Pic
P3 = SDAMB-01215BT00: Fabricant: MULTICOMP; Fournisseur: Farnell; RefFournisseur: 9186140; RefFabricant: SDAMB-01215BT00
R41-R43 = Res1: as R71 on sheet 7-Encodeurs
U5 = SST25VF020B: Fabricant: MICROCHIP; Fournisseur: Farnell; RefFabricant: SST25VF020B-80-4I-SAE; RefFournisseur: 1829953

## Sheet 9-LCD.SchDoc
size A4
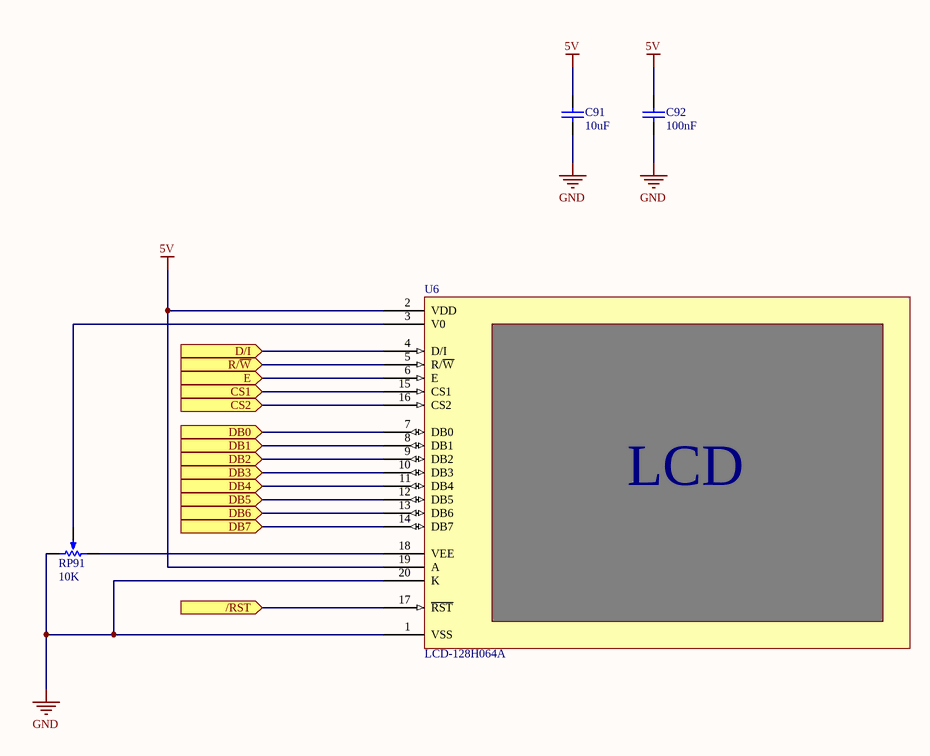
[diagram p7: 9-LCD.SchDoc]

### Parts
C91  10uF  [capa 1206]
C92  100nF  [capa 1206]
RP91  10K  [3313J-1]
U6  LCD-128H064A  [LCD-128H064A]

### Ports
/RST (in), CS1 (in), CS2 (in), D/I (in), DB0 (in), DB1 (in), DB2 (in), DB3 (in), DB4 (in), DB5 (in), DB6 (in), DB7 (in), E (in), R/~{W} (in)

### Nets
5V: C91.1 C92.1 U6.2(VDD) U6.19(A)
GND: C91.2 C92.2 RP91.2(BOT) U6.1(VSS) U6.20(K)
/MCLR: U6.17(~{RST}) ; port /RST
NetRP91_1: RP91.1(TOP) U6.18(VEE)
NetRP91_3: RP91.3(TAP) U6.3(V0)
NetU3_MCP2_1: U6.7(DB0) ; port DB0
NetU3_MCP2_2: U6.8(DB1) ; port DB1
NetU3_MCP2_3: U6.9(DB2) ; port DB2
NetU3_MCP2_4: U6.10(DB3) ; port DB3
NetU3_MCP2_5: U6.11(DB4) ; port DB4
NetU3_MCP2_6: U6.12(DB5) ; port DB5
NetU3_MCP2_7: U6.13(DB6) ; port DB6
NetU3_MCP2_8: U6.14(DB7) ; port DB7
NetU3_MCP2_21: U6.4(D/I) ; port D/I
NetU3_MCP2_22: U6.5(R/~{W}) ; port R/~{W}
NetU3_MCP2_23: U6.6(E) ; port E
NetU3_MCP2_24: U6.15(CS1) ; port CS1
NetU3_MCP2_25: U6.16(CS2) ; port CS2

### Notes on the sheet
- (in symbol LCD-128H064A) LCD

### Library data of the parts
C91 = Cap: as C101 on sheet 1-Pic
C92 = Cap: as C102 on sheet 1-Pic
RP91 = RPot: Potentiometer; Fabricant: BOURNS; Fournisseur: Farnell; RefFabricant: 3313J-1-103E; RefFournisseur: 1612588
U6 = LCD-128H064A: Fournisseur: Adafruit; RefFabricant: KS0108; RefFournisseur: 188; Fabricant: N/A

## Sheet 8-LEDx8.SchDoc
size A4
Used 4 times, as channels 1, 2, 3, 4. Parts and nets are listed once, with the designators drawn on the sheet.
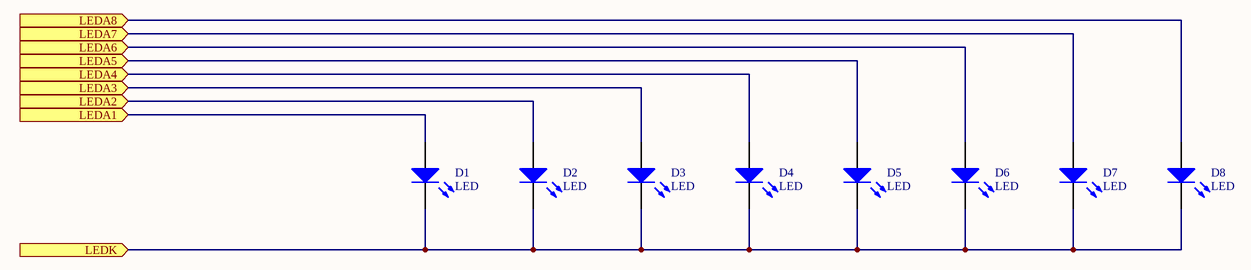
[diagram p8: 8-LEDx8.SchDoc]

### Parts
D1  LED  [LED-3mm]
D2  LED  [LED-3mm]
D3  LED  [LED-3mm]
D4  LED  [LED-3mm]
D5  LED  [LED-3mm]
D6  LED  [LED-3mm]
D7  LED  [LED-3mm]
D8  LED  [LED-3mm]

### Ports
LEDA1 (in), LEDA2 (in), LEDA3 (in), LEDA4 (in), LEDA5 (in), LEDA6 (in), LEDA7 (in), LEDA8 (in), LEDK (in)

### Nets
LEDA1: D1.1(A) ; port LEDA1
LEDA2: D2.1(A) ; port LEDA2
LEDA3: D3.1(A) ; port LEDA3
LEDA4: D4.1(A) ; port LEDA4
LEDA5: D5.1(A) ; port LEDA5
LEDA6: D6.1(A) ; port LEDA6
LEDA7: D7.1(A) ; port LEDA7
LEDA8: D8.1(A) ; port LEDA8
LEDK: D1.2(K) D2.2(K) D3.2(K) D4.2(K) D5.2(K) D6.2(K) D7.2(K) D8.2(K) ; port LEDK

### Channels
1: designators end in _1; ports LEDA1=K1 LEDA2=K2 LEDA3=K3 LEDA4=K4 LEDA5=K5 LEDA6=K6 LEDA7=K7 LEDA8=K8 LEDK=COM4
2: designators end in _2; ports LEDA1=K1 LEDA2=K2 LEDA3=K3 LEDA4=K4 LEDA5=K5 LEDA6=K6 LEDA7=K7 LEDA8=K8 LEDK=COM5
3: designators end in _3; ports LEDA1=K1 LEDA2=K2 LEDA3=K3 LEDA4=K4 LEDA5=K5 LEDA6=K6 LEDA7=K7 LEDA8=K8 LEDK=COM6
4: designators end in _4; ports LEDA1=K1 LEDA2=K2 LEDA3=K3 LEDA4=K4 LEDA5=K5 LEDA6=K6 LEDA7=K7 LEDA8=K8 LEDK=COM7

### Library data of the parts
D1-D8 = LED0: Diffused Green 3mm LED; Fabricant: CREE; Fournisseur: Farnell; RefFabricant: C503B-BCN-CV0Z0462; RefFournisseur: 2414443

## Sheet 6-CodSwitch.SchDoc
size A4
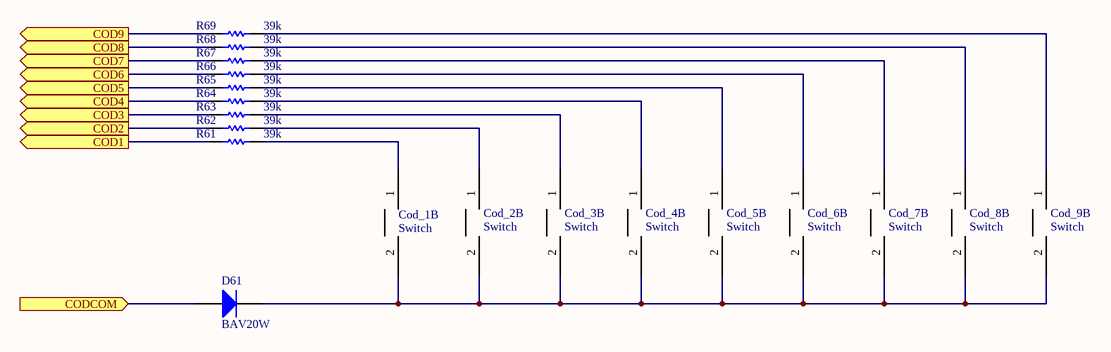
[diagram p9: 6-CodSwitch.SchDoc]

### Parts
(Parts that share a designator on the sheet are numbered #1, #2 ... from top to bottom, then left to right.)
Cod_1#2  Switch  [PEC11R-4xxxF-Sxxxx]  (part B of 2)
Cod_2#2  Switch  [PEC11R-4xxxF-Sxxxx]  (part B of 2)
Cod_3#2  Switch  [PEC11R-4xxxF-Sxxxx]  (part B of 2)
Cod_4#2  Switch  [PEC11R-4xxxF-Sxxxx]  (part B of 2)
Cod_5#2  Switch  [PEC11R-4xxxF-Sxxxx]  (part B of 2)
Cod_6#2  Switch  [PEC11R-4xxxF-Sxxxx]  (part B of 2)
Cod_7#2  Switch  [PEC11R-4xxxF-Sxxxx]  (part B of 2)
Cod_8#2  Switch  [PEC11R-4xxxF-Sxxxx]  (part B of 2)
Cod_9#2  Switch  [PEC11R-4xxxF-Sxxxx]  (part B of 2)
D61  BAV20W  [Diode SOD-123]
R61  39k  [RES 1206]
R62  39k  [RES 1206]
R63  39k  [RES 1206]
R64  39k  [RES 1206]
R65  39k  [RES 1206]
R66  39k  [RES 1206]
R67  39k  [RES 1206]
R68  39k  [RES 1206]
R69  39k  [RES 1206]

### Ports
COD1 (out), COD2 (out), COD3 (out), COD4 (out), COD5 (out), COD6 (out), COD7 (out), COD8 (out), COD9 (out), CODCOM (in)

### Nets
COM3: D61.1(A) ; port CODCOM
K1: R61.1 ; port COD1
K2: R62.1 ; port COD2
K3: R63.1 ; port COD3
K4: R64.1 ; port COD4
K5: R65.1 ; port COD5
K6: R66.1 ; port COD6
K7: R67.1 ; port COD7
K8: R68.1 ; port COD8
K9: R69.1 ; port COD9
NetCod_1#2_1: Cod_1#2.1 R61.2
NetCod_1#2_2: Cod_1#2.2 Cod_2#2.2 Cod_3#2.2 Cod_4#2.2 Cod_5#2.2 Cod_6#2.2 Cod_7#2.2 Cod_8#2.2 Cod_9#2.2 D61.2(K)
NetCod_2#2_1: Cod_2#2.1 R62.2
NetCod_3#2_1: Cod_3#2.1 R63.2
NetCod_4#2_1: Cod_4#2.1 R64.2
NetCod_5#2_1: Cod_5#2.1 R65.2
NetCod_6#2_1: Cod_6#2.1 R66.2
NetCod_7#2_1: Cod_7#2.1 R67.2
NetCod_8#2_1: Cod_8#2.1 R68.2
NetCod_9#2_1: Cod_9#2.1 R69.2

### Library data of the parts
Cod_1#2 Cod_2#2 Cod_3#2 Cod_4#2 Cod_5#2 Cod_6#2 Cod_7#2 Cod_8#2 = Cod: Fabricant: BOURNS; Fournisseur: Farnell; RefFabricant: PEC11R-4020F-S0024; RefFournisseur: 2663519
Cod_9#2 = Cod: Fabricant: BOURNS; Fournisseur: Farnell; RefFabricant: PEC11R-4220F-S0024; RefFournisseur: 2663527
D61 = Diode: Default Diode; Fabricant: DIODES INC.; Fournisseur: Farnell; RefFournisseur: 1902417; RefFabricant: BAV20W
R61-R69 = Res1: Resistor; Fabricant: MULTICOMP; Fournisseur: Farnell; RefFabricant: MC0125W1206539K; RefFournisseur: 9337407

## Sheet 5-Pads.SchDoc
size A4
Used 2 times, as channels 2, 1. Parts and nets are listed once, with the designators drawn on the sheet.
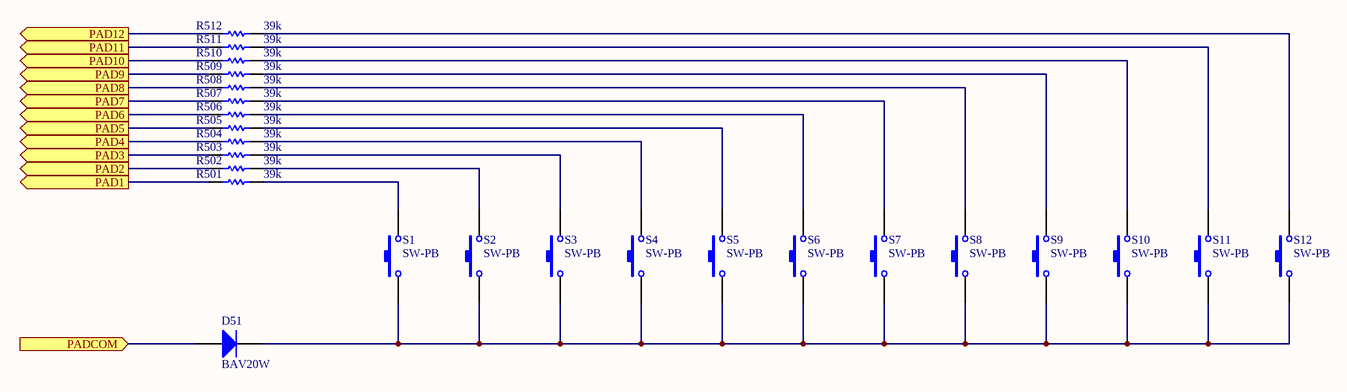
[diagram p10: 5-Pads.SchDoc]

### Parts
D51  BAV20W  [Diode SOD-123]
R501  39k  [RES 1206]
R502  39k  [RES 1206]
R503  39k  [RES 1206]
R504  39k  [RES 1206]
R505  39k  [RES 1206]
R506  39k  [RES 1206]
R507  39k  [RES 1206]
R508  39k  [RES 1206]
R509  39k  [RES 1206]
R510  39k  [RES 1206]
R511  39k  [RES 1206]
R512  39k  [RES 1206]
S1  SW-PB  [PAD]
S2  SW-PB  [PAD]
S3  SW-PB  [PAD]
S4  SW-PB  [PAD]
S5  SW-PB  [PAD]
S6  SW-PB  [PAD]
S7  SW-PB  [PAD]
S8  SW-PB  [PAD]
S9  SW-PB  [PAD]
S10  SW-PB  [PAD]
S11  SW-PB  [PAD]
S12  SW-PB  [PAD]

### Ports
PAD1 (out), PAD2 (out), PAD3 (out), PAD4 (out), PAD5 (out), PAD6 (out), PAD7 (out), PAD8 (out), PAD9 (out), PAD10 (out), PAD11 (out), PAD12 (out), PADCOM (in)

### Nets
PAD1: R501.1 ; port PAD1
PAD2: R502.1 ; port PAD2
PAD3: R503.1 ; port PAD3
PAD4: R504.1 ; port PAD4
PAD5: R505.1 ; port PAD5
PAD6: R506.1 ; port PAD6
PAD7: R507.1 ; port PAD7
PAD8: R508.1 ; port PAD8
PAD9: R509.1 ; port PAD9
PAD10: R510.1 ; port PAD10
PAD11: R511.1 ; port PAD11
PAD12: R512.1 ; port PAD12
PADCOM: D51.1(A) ; port PADCOM
NetD51_2: D51.2(K) S1.1 S2.1 S3.1 S4.1 S5.1 S6.1 S7.1 S8.1 S9.1 S10.1 S11.1 S12.1
NetR501_2: R501.2 S1.2
NetR502_2: R502.2 S2.2
NetR503_2: R503.2 S3.2
NetR504_2: R504.2 S4.2
NetR505_2: R505.2 S5.2
NetR506_2: R506.2 S6.2
NetR507_2: R507.2 S7.2
NetR508_2: R508.2 S8.2
NetR509_2: R509.2 S9.2
NetR510_2: R510.2 S10.2
NetR511_2: R511.2 S11.2
NetR512_2: R512.2 S12.2

### Channels
2: designators end in _2; ports PAD1=K1 PAD2=K2 PAD3=K3 PAD4=K4 PAD5=K5 PAD6=K6 PAD7=K7 PAD8=K8 PAD9=K9 PAD10=K10 PAD11=K11 PAD12=K12 PADCOM=COM2
1: designators end in _1; ports PAD1=K1 PAD2=K2 PAD3=K3 PAD4=K4 PAD5=K5 PAD6=K6 PAD7=K7 PAD8=K8 PAD9=K9 PAD10=K10 PAD11=K11 PAD12=K12 PADCOM=COM1

### Library data of the parts
D51 = Diode: as D61 on sheet 6-CodSwitch; RefFabricant: BAV20W
R501-R512 = Res1: as R61 on sheet 6-CodSwitch
S1-S12 = SW-PB: Switch; Fabricant: N/A; Fournisseur: N/A; RefFabricant: N/A; RefFournisseur: N/A

## Nets that join several sheets
3.3V: 1-Pic (8 pins), 1 (R71_1.2 R72_1.2), 3-HT16K33 (R31.1 R32.2), 10-Power (6 pins), MCP1 (C21_MCP1.1 C22_MCP1.1 U3_MCP1.9), 4-Memorie (9 pins), MCP2 (C21_MCP2.1 C22_MCP2.1 U3_MCP2.9), 2 (R71_2.2 R72_2.2), 3 (R71_3.2 R72_3.2), 4 (R71_4.2 R72_4.2), 5 (R71_5.2 R72_5.2), 6 (R71_6.2 R72_6.2), 7 (R71_7.2 R72_7.2), 8 (R71_8.2 R72_8.2), 9 (R71_9.2 R72_9.2)
5V: 1-Pic (5 pins), 3-HT16K33 (7 pins), 10-Power (6 pins), 9-LCD (C91.1 C92.1 U6.2 U6.19)
GND: 1-Pic (18 pins), 1 (C71_1.1 C72_1.2 Cod_1#1.C), 3-HT16K33 (7 pins), 10-Power (13 pins), MCP1 (6 pins), 4-Memorie (7 pins), MCP2 (6 pins), 2 (C71_2.1 C72_2.2 Cod_2#1.C), 3 (C71_3.1 C72_3.2 Cod_3#1.C), 4 (C71_4.1 C72_4.2 Cod_4#1.C), 5 (C71_5.1 C72_5.2 Cod_5#1.C), 6 (C71_6.1 C72_6.2 Cod_6#1.C), 7 (C71_7.1 C72_7.2 Cod_7#1.C), 8 (C71_8.1 C72_8.2 Cod_8#1.C), 9 (C71_9.1 C72_9.2 Cod_9#1.C), 9-LCD (5 pins)
/CS COD: 1-Pic (U1.22), MCP1 (U3_MCP1.11)
/CS Flash: 1-Pic (U1.23), 4-Memorie (U5.1)
/CS LCD: 1-Pic (U1.21), MCP2 (U3_MCP2.11)
/CS SD: 1-Pic (U1.26), 4-Memorie (P3.1)
/MCLR: 1-Pic (C111.2 P2.1 R103.1 U1.1), MCP1 (U3_MCP1.18), MCP2 (U3_MCP2.18), 9-LCD (U6.17)
COD9A: 1-Pic (U1.6), 9 (R73_9.2)
COD9B: 1-Pic (U1.7), 9 (R74_9.2)
COM1: 3-HT16K33 (U4.3), 1 (D51_1.1)
COM2: 3-HT16K33 (U4.4), 2 (D51_2.1)
COM3: 3-HT16K33 (U4.5), 6-CodSwitch (D61.1)
COM4: 3-HT16K33 (U4.6), 1 (8 pins)
COM5: 3-HT16K33 (U4.7), 2 (8 pins)
COM6: 3-HT16K33 (U4.8), 3 (8 pins)
COM7: 3-HT16K33 (U4.9), 4 (8 pins)
INT HT16: 1-Pic (U1.16), 3-HT16K33 (U4.10)
INTA MCP: 1-Pic (U1.4), MCP1 (U3_MCP1.20)
INTB MCP: 1-Pic (U1.5), MCP1 (U3_MCP1.19)
K1: 3-HT16K33 (U4.22), 1 (D1_1.1), 6-CodSwitch (R61.1), 2 (R501_2.1), 2 (D1_2.1), 3 (D1_3.1), 4 (D1_4.1), 1 (R501_1.1)
K2: 3-HT16K33 (U4.21), 1 (D2_1.1), 6-CodSwitch (R62.1), 2 (R502_2.1), 2 (D2_2.1), 3 (D2_3.1), 4 (D2_4.1), 1 (R502_1.1)
K3: 3-HT16K33 (U4.20), 1 (D3_1.1), 6-CodSwitch (R63.1), 2 (R503_2.1), 2 (D3_2.1), 3 (D3_3.1), 4 (D3_4.1), 1 (R503_1.1)
K4: 3-HT16K33 (U4.19), 1 (D4_1.1), 6-CodSwitch (R64.1), 2 (R504_2.1), 2 (D4_2.1), 3 (D4_3.1), 4 (D4_4.1), 1 (R504_1.1)
K5: 3-HT16K33 (U4.18), 1 (D5_1.1), 6-CodSwitch (R65.1), 2 (R505_2.1), 2 (D5_2.1), 3 (D5_3.1), 4 (D5_4.1), 1 (R505_1.1)
K6: 3-HT16K33 (U4.17), 1 (D6_1.1), 6-CodSwitch (R66.1), 2 (R506_2.1), 2 (D6_2.1), 3 (D6_3.1), 4 (D6_4.1), 1 (R506_1.1)
K7: 3-HT16K33 (U4.16), 1 (D7_1.1), 6-CodSwitch (R67.1), 2 (R507_2.1), 2 (D7_2.1), 3 (D7_3.1), 4 (D7_4.1), 1 (R507_1.1)
K8: 3-HT16K33 (U4.15), 1 (D8_1.1), 6-CodSwitch (R68.1), 2 (R508_2.1), 2 (D8_2.1), 3 (D8_3.1), 4 (D8_4.1), 1 (R508_1.1)
K9: 3-HT16K33 (U4.14), 6-CodSwitch (R69.1), 2 (R509_2.1), 1 (R509_1.1)
K10: 3-HT16K33 (U4.13), 2 (R510_2.1), 1 (R510_1.1)
K11: 3-HT16K33 (U4.12), 2 (R511_2.1), 1 (R511_1.1)
K12: 3-HT16K33 (U4.11), 2 (R512_2.1), 1 (R512_1.1)
MISO: 1-Pic (U1.3), MCP1 (U3_MCP1.14), 4-Memorie (P3.7 U5.2), MCP2 (U3_MCP2.14)
MOSI: 1-Pic (U1.24), MCP1 (U3_MCP1.13), 4-Memorie (P3.2 U5.5), MCP2 (U3_MCP2.13)
NetR73_1_2: 1 (R73_1.2), MCP1 (U3_MCP1.21)
NetR73_2_2: MCP1 (U3_MCP1.22), 2 (R73_2.2)
NetR73_3_2: MCP1 (U3_MCP1.23), 3 (R73_3.2)
NetR73_4_2: MCP1 (U3_MCP1.24), 4 (R73_4.2)
NetR73_5_2: MCP1 (U3_MCP1.25), 5 (R73_5.2)
NetR73_6_2: MCP1 (U3_MCP1.26), 6 (R73_6.2)
NetR73_7_2: MCP1 (U3_MCP1.27), 7 (R73_7.2)
NetR73_8_2: MCP1 (U3_MCP1.28), 8 (R73_8.2)
NetR74_1_2: 1 (R74_1.2), MCP1 (U3_MCP1.1)
NetR74_2_2: MCP1 (U3_MCP1.2), 2 (R74_2.2)
NetR74_3_2: MCP1 (U3_MCP1.3), 3 (R74_3.2)
NetR74_4_2: MCP1 (U3_MCP1.4), 4 (R74_4.2)
NetR74_5_2: MCP1 (U3_MCP1.5), 5 (R74_5.2)
NetR74_6_2: MCP1 (U3_MCP1.6), 6 (R74_6.2)
NetR74_7_2: MCP1 (U3_MCP1.7), 7 (R74_7.2)
NetR74_8_2: MCP1 (U3_MCP1.8), 8 (R74_8.2)
NetU3_MCP2_1: MCP2 (U3_MCP2.1), 9-LCD (U6.7)
NetU3_MCP2_2: MCP2 (U3_MCP2.2), 9-LCD (U6.8)
NetU3_MCP2_3: MCP2 (U3_MCP2.3), 9-LCD (U6.9)
NetU3_MCP2_4: MCP2 (U3_MCP2.4), 9-LCD (U6.10)
NetU3_MCP2_5: MCP2 (U3_MCP2.5), 9-LCD (U6.11)
NetU3_MCP2_6: MCP2 (U3_MCP2.6), 9-LCD (U6.12)
NetU3_MCP2_7: MCP2 (U3_MCP2.7), 9-LCD (U6.13)
NetU3_MCP2_8: MCP2 (U3_MCP2.8), 9-LCD (U6.14)
NetU3_MCP2_21: MCP2 (U3_MCP2.21), 9-LCD (U6.4)
NetU3_MCP2_22: MCP2 (U3_MCP2.22), 9-LCD (U6.5)
NetU3_MCP2_23: MCP2 (U3_MCP2.23), 9-LCD (U6.6)
NetU3_MCP2_24: MCP2 (U3_MCP2.24), 9-LCD (U6.15)
NetU3_MCP2_25: MCP2 (U3_MCP2.25), 9-LCD (U6.16)
SCK: 1-Pic (U1.25), MCP1 (U3_MCP1.12), 4-Memorie (P3.5 U5.6), MCP2 (U3_MCP2.12)
SCL: 1-Pic (U1.17), 3-HT16K33 (R32.1 U4.26)
SD Switch: 1-Pic (U1.12), 4-Memorie (P3.S2 R41.1)
SDA: 1-Pic (U1.18), 3-HT16K33 (R31.2 U4.27)